# Altium schematic sheet (2).SchDoc
size A4
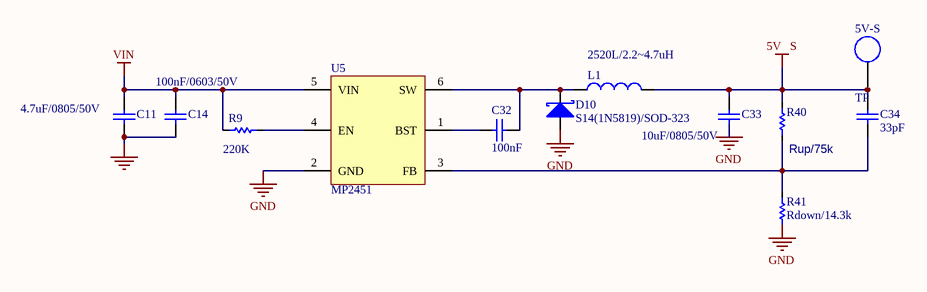
[diagram p0: (2).SchDoc]

## Parts
5V-S  TP
C11  4.7uF/0805/50V  [0603C]
C14  100nF/0603/50V  [0603C]
C32  100nF  [0603C]
C33  10uF/0805/50V  [0603C]
C34  33pF  [0603C]
D10  S14(1N5819)/SOD-323  [SMA/DO-214AC]
L1  2520L/2.2~4.7uH  [0420L]
R9  220K  [0603R]
R40  Rup/75k  [0603R]
R41  Rdown/14.3k  [0603R]
U5  MP2451  [SOT23-6L]

## Nets
5V   S: 5V-S.1 C33.2 C34.2 L1.2 R40.2
GND: C11.1 C14.1 C33.1 D10.1 U5.2(GND)
VIN: C11.2 C14.2 R9.1 U5.5(VIN)
NetC32_1: C32.1 U5.1(BST)
NetC32_2: C32.2 D10.2 L1.1 U5.6(SW)
NetC34_1: C34.1 R40.1 R41.2 U5.3(FB)
NetR9_2: R9.2 U5.4(EN)

Not connected (* = marked no-connect by the designer): R41 1

## Notes on the sheet
- Labels drawn without touching a wire or pin: GND

## Library data of the parts
5V-S = ?
C11 C14 C32-C34 = Cap: Capacitor; Value: 100pF; Published: 8-Jun-2000; LatestRevisionDate: 17-Jul-2002; LatestRevisionNote: Re-released for DXP Platform.; PackageReference: RAD-0.3; Publisher: Altium Limited; PackageDescription: Radial Cap, Thru-Hole; 2 Leads; 0.3 in Pin Spacing
D10 = D Schottky_SOD323: Schottky Diode; Published: 8-Jun-2000; LatestRevisionDate: 17-Jul-2002; LatestRevisionNote: Re-released for DXP Platform.; PackageReference: SMB; Publisher: Altium Limited; PackageDescription: DO-214-AA/SMB; 2 C-Bend Leads; Body 5.3 x 3.6 mm, inc. leads (LxW); Code_JEDEC: DO-214-AA
L1 = Inductor: Code_IEC: 1005; Value: 10mH; Published: 8-Jun-2000; LatestRevisionDate: 29-May-2009; LatestRevisionNote: IPC-7351 Footprint Added.; PackageReference: 0402-A; Publisher: Altium Limited; PackageDescription: Chip Inductor; Code_JEITA: 0402
R9 R40 R41 = Res1: Resistor; Value: 1K; Published: 8-Jun-2000; LatestRevisionDate: 17-Jul-2002; LatestRevisionNote: Re-released for DXP Platform.; PackageReference: AXIAL-0.3; Publisher: Altium Limited; PackageDescription: Axial Device, Thru-Hole; 2 Leads; 0.3 in Pin Spacing
U5 = MP2451: 开关电源0.6A